# EAGLE schematic TN Deck__Main_Board (EAGLE 9.7.0)
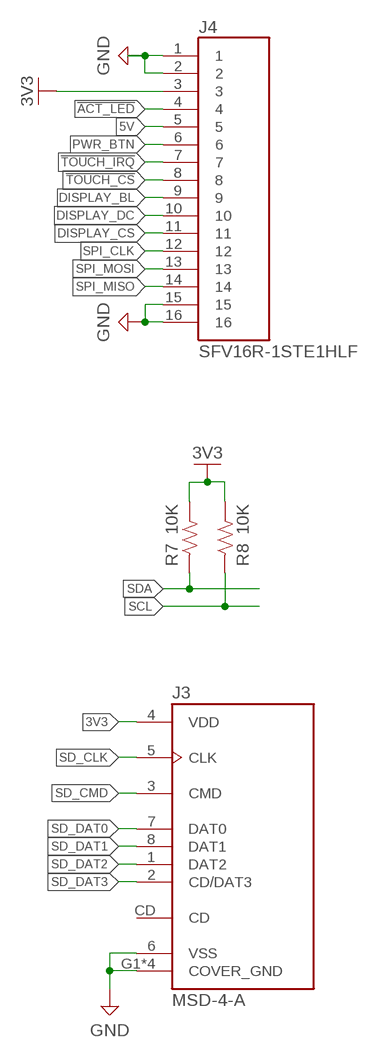
[diagram p0: schematic, sheet 1, part 1 of 2]
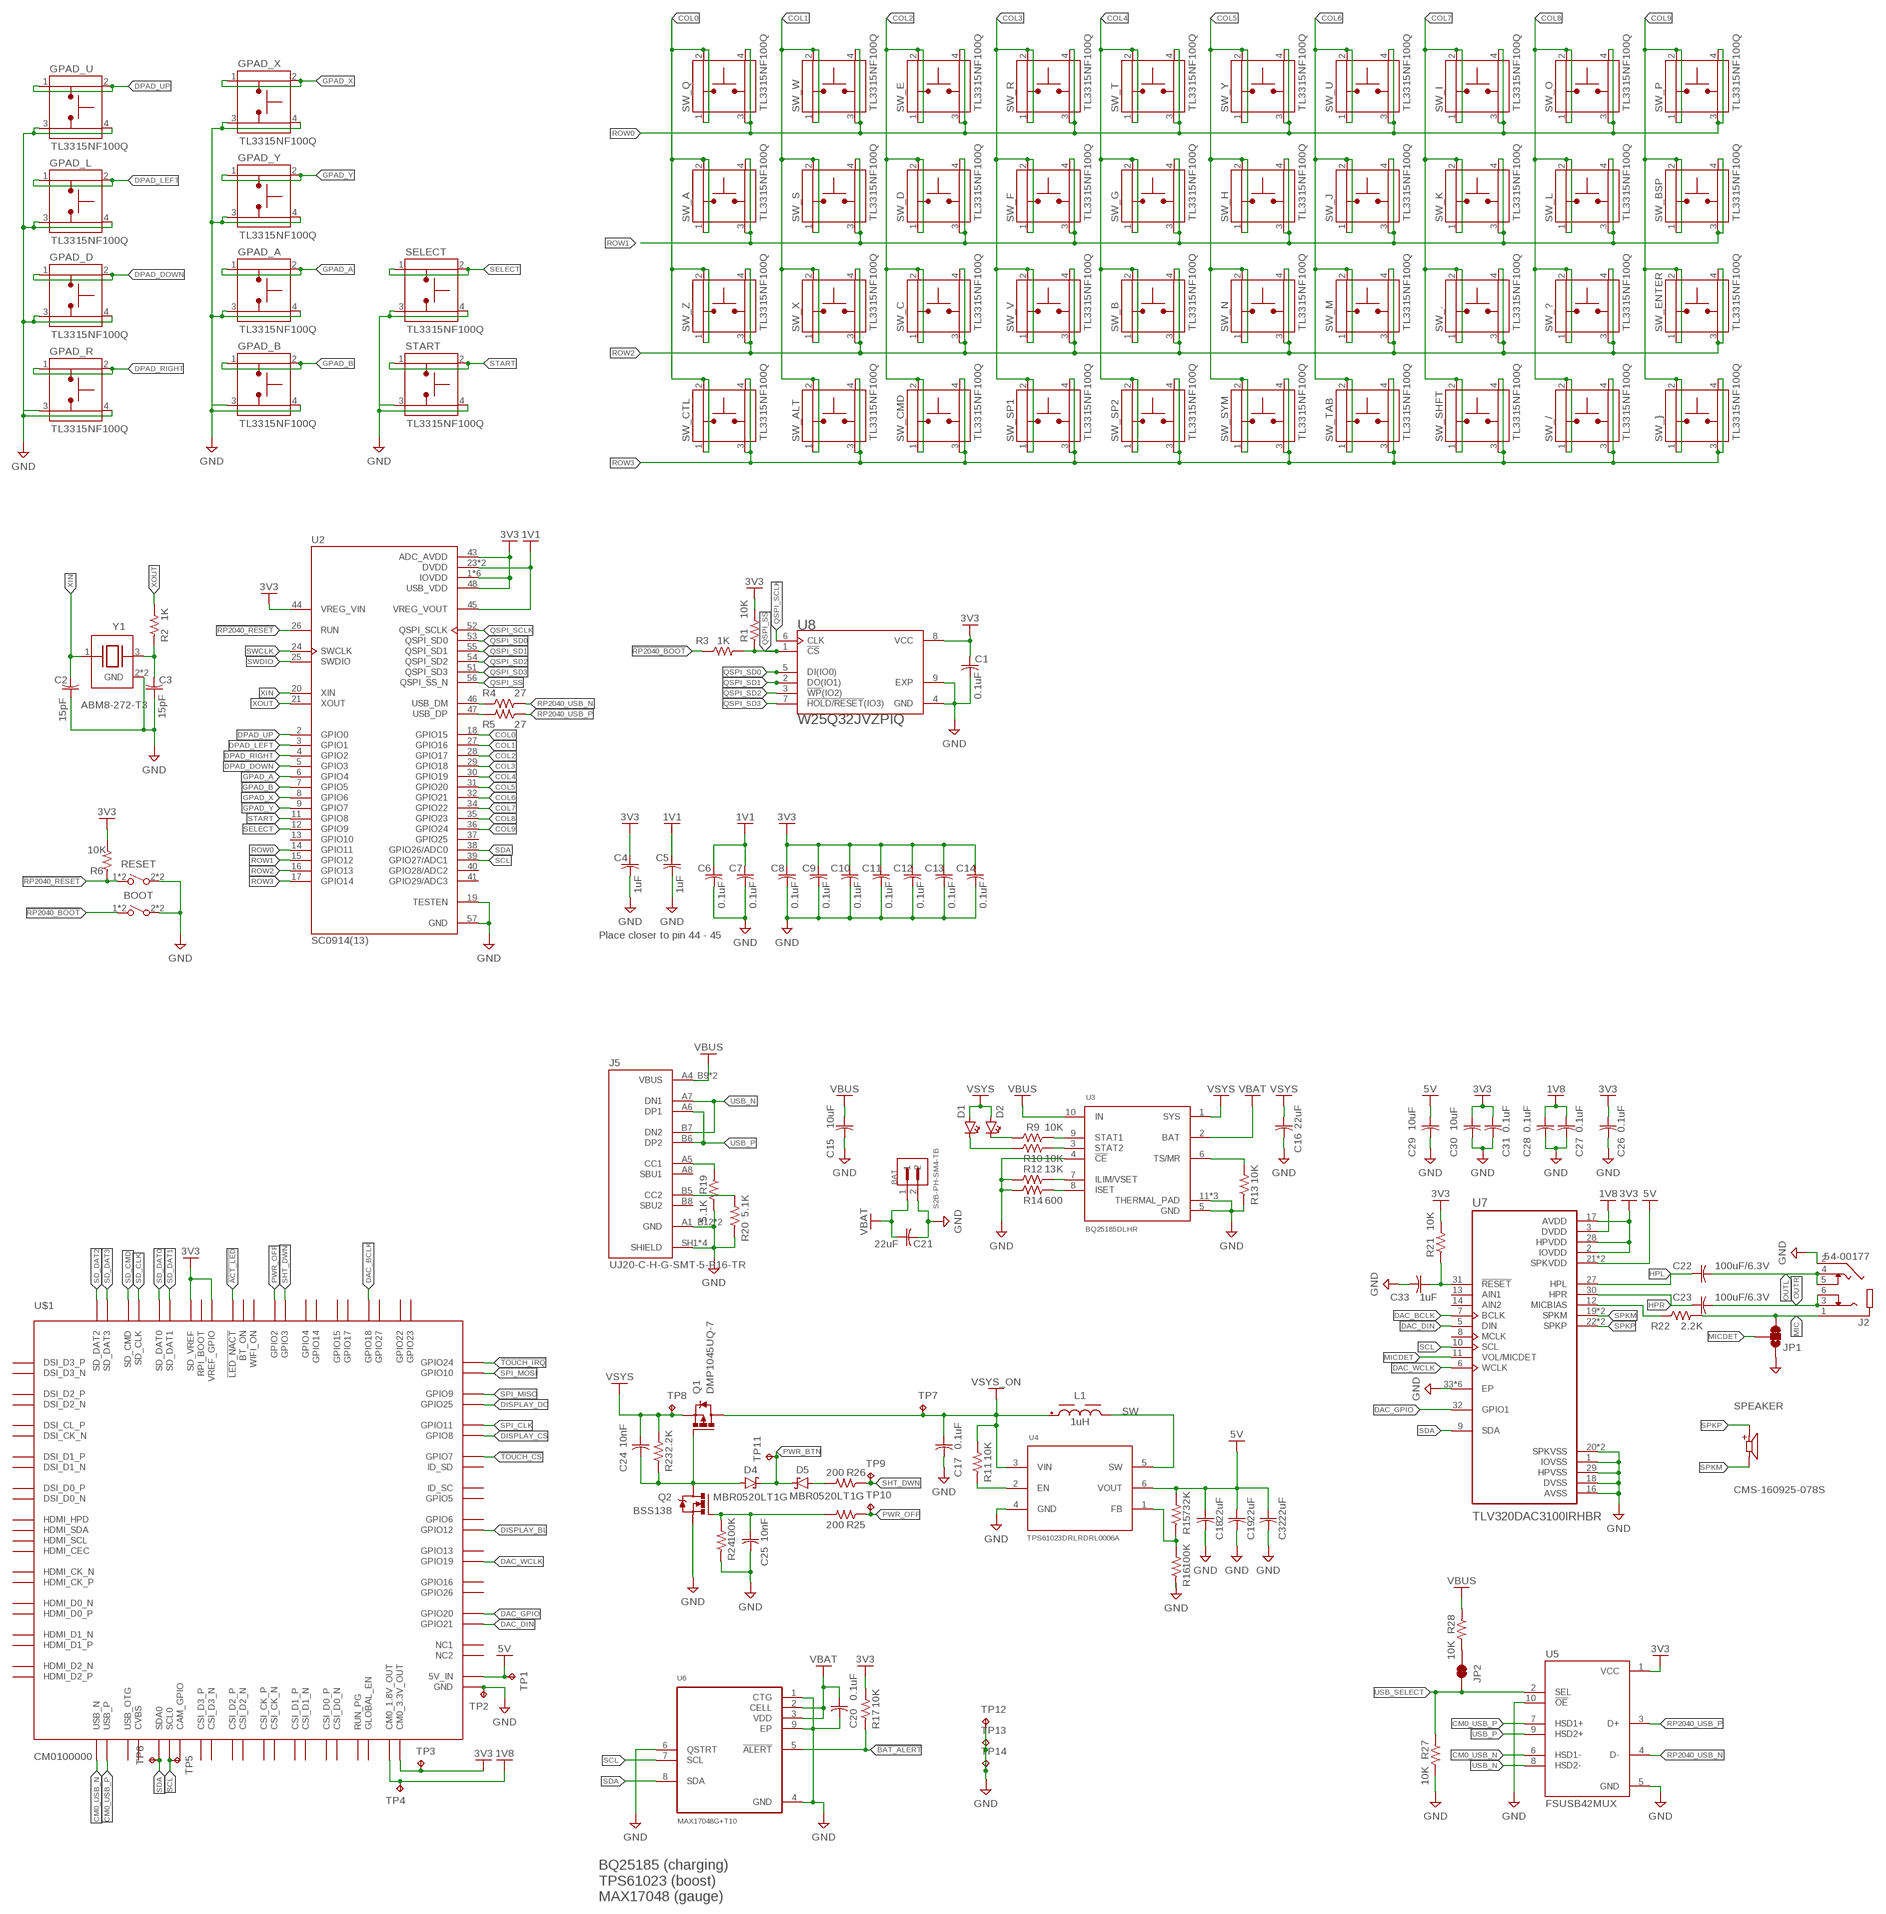
[diagram p1: schematic, sheet 1, part 2 of 2]

## Parts
BAT  S2B-PH-SM4-TB  [JST_S2B-PH-SM4-TB]
BOOT  SPST-NO_SWITCH_KMR2  [KMR2]
C1  0.1uF  C-US_CHIP-0603(1608-METRIC)  [CAPC1608X85]
C2  15pF  C-US_CHIP-0603(1608-METRIC)  [CAPC1608X85]
C3  15pF  C-US_CHIP-0603(1608-METRIC)  [CAPC1608X85]
C4  1uF  C-US_CHIP-0603(1608-METRIC)  [CAPC1608X85]
C5  1uF  C-US_CHIP-0603(1608-METRIC)  [CAPC1608X85]
C6  0.1uF  C-US_CHIP-0603(1608-METRIC)  [CAPC1608X85]
C7  0.1uF  C-US_CHIP-0603(1608-METRIC)  [CAPC1608X85]
C8  0.1uF  C-US_CHIP-0603(1608-METRIC)  [CAPC1608X85]
C9  0.1uF  C-US_CHIP-0603(1608-METRIC)  [CAPC1608X85]
C10  0.1uF  C-US_CHIP-0603(1608-METRIC)  [CAPC1608X85]
C11  0.1uF  C-US_CHIP-0603(1608-METRIC)  [CAPC1608X85]
C12  0.1uF  C-US_CHIP-0603(1608-METRIC)  [CAPC1608X85]
C13  0.1uF  C-US_CHIP-0603(1608-METRIC)  [CAPC1608X85]
C14  0.1uF  C-US_CHIP-0603(1608-METRIC)  [CAPC1608X85]
C15  10uF  C-US_CHIP-0805(2012-METRIC)  [CAPC2012X110]
C16  22uF  C-US_CHIP-0805(2012-METRIC)  [CAPC2012X110]
C17  0.1uF  C-US_CHIP-0603(1608-METRIC)  [CAPC1608X85]
C18  22uF  C-US_CHIP-0805(2012-METRIC)  [CAPC2012X110]
C19  22uF  C-US_CHIP-0805(2012-METRIC)  [CAPC2012X110]
C20  0.1uF  C-US_CHIP-0603(1608-METRIC)  [CAPC1608X85]
C21  22uF  C-US_CHIP-0805(2012-METRIC)  [CAPC2012X110]
C22  100uF/6.3V  C-US_CHIP-1206(3216-METRIC)  [CAPC3216X135]
C23  100uF/6.3V  C-US_CHIP-1206(3216-METRIC)  [CAPC3216X135]
C24  10nF  C-US_CHIP-0603(1608-METRIC)  [CAPC1608X85]
C25  10nF  C-US_CHIP-0603(1608-METRIC)  [CAPC1608X85]
C26  0.1uF  C-US_CHIP-0603(1608-METRIC)  [CAPC1608X85]
C27  0.1uF  C-US_CHIP-0603(1608-METRIC)  [CAPC1608X85]
C28  0.1uF  C-US_CHIP-0603(1608-METRIC)  [CAPC1608X85]
C29  10uF  C-US_CHIP-0805(2012-METRIC)  [CAPC2012X110]
C30  10uF  C-US_CHIP-0805(2012-METRIC)  [CAPC2012X110]
C31  0.1uF  C-US_CHIP-0603(1608-METRIC)  [CAPC1608X85]
C32  22uF  C-US_CHIP-0805(2012-METRIC)  [CAPC2012X110]
C33  1uF  C-US_CHIP-0603(1608-METRIC)  [CAPC1608X85]
D1  CHIP-FLAT-G_0603-0.80MM  [LEDC1608X80N_FLAT-G]
D2  CHIP-FLAT-R_0603-0.80MM  [LEDC1608X80N_FLAT-R]
D4  MBR0520LT1G  SCHOTTKY_MBR0520LT1GDO-219  [SODFL3718X115]
D5  MBR0520LT1G  SCHOTTKY_MBR0520LT1GDO-219  [SODFL3718X115]
GPAD_A  TL3315NF100Q  [TL3315NF100Q]
GPAD_B  TL3315NF100Q  [TL3315NF100Q]
GPAD_D  TL3315NF100Q  [TL3315NF100Q]
GPAD_L  TL3315NF100Q  [TL3315NF100Q]
GPAD_R  TL3315NF100Q  [TL3315NF100Q]
GPAD_U  TL3315NF100Q  [TL3315NF100Q]
GPAD_X  TL3315NF100Q  [TL3315NF100Q]
GPAD_Y  TL3315NF100Q  [TL3315NF100Q]
J2  54-00177  [TENSILITY_54-00177]
J3  MSD-4-A  [CUI_MSD-4-A]
J4  SFV16R-1STE1HLF  [AMPHENOL_SFV16R-1STE1HLF]
J5  UJ20-C-H-G-SMT-5-P16-TR  [SAMESKY_UJ20-C-H-G-SMT-5-P16-TR]
JP1  JUMPER-SMT_3_1-NC_TRACE_SILK  [SMT-JUMPER_3_1-NC_TRACE_SILK]
JP2  JUMPER-SMT_2_NC_TRACE_NO-SILK  [SMT-JUMPER_2_NC_TRACE_NO-SILK]
L1  1uH  WE-XHMI_4020_74439323010  [WE-XHMI_4020]
Q1  DMP1045UQ-7  PMOSFET_SOT23-GSD  [SOT23]
Q2  BSS138  NMOSFET_SOT23-GSD  [SOT23]
R1  10K  R-US_CHIP-0603(1608-METRIC)  [RESC1608X60]
R2  1K  R-US_CHIP-0603(1608-METRIC)  [RESC1608X60]
R3  1K  R-US_CHIP-0603(1608-METRIC)  [RESC1608X60]
R4  27  R-US_CHIP-0603(1608-METRIC)  [RESC1608X60]
R5  27  R-US_CHIP-0603(1608-METRIC)  [RESC1608X60]
R6  10K  R-US_CHIP-0603(1608-METRIC)  [RESC1608X60]
R7  10K  R-US_CHIP-0603(1608-METRIC)  [RESC1608X60]
R8  10K  R-US_CHIP-0603(1608-METRIC)  [RESC1608X60]
R9  10K  R-US_CHIP-0603(1608-METRIC)  [RESC1608X60]
R10  10K  R-US_CHIP-0603(1608-METRIC)  [RESC1608X60]
R11  10K  R-US_CHIP-0603(1608-METRIC)  [RESC1608X60]
R12  13K  R-US_CHIP-0603(1608-METRIC)  [RESC1608X60]
R13  10K  R-US_CHIP-0603(1608-METRIC)  [RESC1608X60]
R14  600  R-US_CHIP-0603(1608-METRIC)  [RESC1608X60]
R15  732K  R-US_CHIP-0603(1608-METRIC)  [RESC1608X60]
R16  100K  R-US_CHIP-0603(1608-METRIC)  [RESC1608X60]
R17  10K  R-US_CHIP-0603(1608-METRIC)  [RESC1608X60]
R19  5.1K  R-US_CHIP-0603(1608-METRIC)  [RESC1608X60]
R20  5.1K  R-US_CHIP-0603(1608-METRIC)  [RESC1608X60]
R21  10K  R-US_CHIP-0603(1608-METRIC)  [RESC1608X60]
R22  2.2K  R-US_CHIP-0603(1608-METRIC)  [RESC1608X60]
R23  2.2K  R-US_CHIP-0603(1608-METRIC)  [RESC1608X60]
R24  100K  R-US_CHIP-0603(1608-METRIC)  [RESC1608X60]
R25  200  R-US_CHIP-0603(1608-METRIC)  [RESC1608X60]
R26  200  R-US_CHIP-0603(1608-METRIC)  [RESC1608X60]
R27  10K  R-US_CHIP-0603(1608-METRIC)  [RESC1608X60]
R28  10K  R-US_CHIP-0603(1608-METRIC)  [RESC1608X60]
RESET  SPST-NO_SWITCH_KMR2  [KMR2]
SELECT  TL3315NF100Q  [TL3315NF100Q]
SPEAKER  CMS-160925-078S  [SPKR_CMS-160925-078S]
START  TL3315NF100Q  [TL3315NF100Q]
SW_.  TL3315NF100Q  [TL3315NF100Q]
SW_/  TL3315NF100Q  [TL3315NF100Q]
SW_?  TL3315NF100Q  [TL3315NF100Q]
SW_A  TL3315NF100Q  [TL3315NF100Q]
SW_ALT  TL3315NF100Q  [TL3315NF100Q]
SW_B  TL3315NF100Q  [TL3315NF100Q]
SW_BSP  TL3315NF100Q  [TL3315NF100Q]
SW_C  TL3315NF100Q  [TL3315NF100Q]
SW_CMD  TL3315NF100Q  [TL3315NF100Q]
SW_CTL  TL3315NF100Q  [TL3315NF100Q]
SW_D  TL3315NF100Q  [TL3315NF100Q]
SW_E  TL3315NF100Q  [TL3315NF100Q]
SW_ENTER  TL3315NF100Q  [TL3315NF100Q]
SW_F  TL3315NF100Q  [TL3315NF100Q]
SW_G  TL3315NF100Q  [TL3315NF100Q]
SW_H  TL3315NF100Q  [TL3315NF100Q]
SW_I  TL3315NF100Q  [TL3315NF100Q]
SW_J  TL3315NF100Q  [TL3315NF100Q]
SW_K  TL3315NF100Q  [TL3315NF100Q]
SW_L  TL3315NF100Q  [TL3315NF100Q]
SW_M  TL3315NF100Q  [TL3315NF100Q]
SW_N  TL3315NF100Q  [TL3315NF100Q]
SW_O  TL3315NF100Q  [TL3315NF100Q]
SW_P  TL3315NF100Q  [TL3315NF100Q]
SW_Q  TL3315NF100Q  [TL3315NF100Q]
SW_R  TL3315NF100Q  [TL3315NF100Q]
SW_S  TL3315NF100Q  [TL3315NF100Q]
SW_SHFT  TL3315NF100Q  [TL3315NF100Q]
SW_SP1  TL3315NF100Q  [TL3315NF100Q]
SW_SP2  TL3315NF100Q  [TL3315NF100Q]
SW_SYM  TL3315NF100Q  [TL3315NF100Q]
SW_T  TL3315NF100Q  [TL3315NF100Q]
SW_TAB  TL3315NF100Q  [TL3315NF100Q]
SW_U  TL3315NF100Q  [TL3315NF100Q]
SW_V  TL3315NF100Q  [TL3315NF100Q]
SW_W  TL3315NF100Q  [TL3315NF100Q]
SW_X  TL3315NF100Q  [TL3315NF100Q]
SW_Y  TL3315NF100Q  [TL3315NF100Q]
SW_Z  TL3315NF100Q  [TL3315NF100Q]
SW_}  TL3315NF100Q  [TL3315NF100Q]
TP1  TPB1,27  [B1,27]
TP2  TPB1,27  [B1,27]
TP3  TPB1,27  [B1,27]
TP4  TPB1,27  [B1,27]
TP5  TPB1,27  [B1,27]
TP6  TPB1,27  [B1,27]
TP7  TPB1,27  [B1,27]
TP8  TPB1,27  [B1,27]
TP9  TPB1,27  [B1,27]
TP10  TPB1,27  [B1,27]
TP11  TPB1,27  [B1,27]
TP12  TPB1,27  [B1,27]
TP13  TPB1,27  [B1,27]
TP14  TPB1,27  [B1,27]
U2  SC0914(13)  [QFN40P700X700X90-57N]
U3  BQ25185DLHR  [IC_BQ25185DLHR]
U4  TPS61023DRLRDRL0006A  [DRL0006A]
U5  FSUSB42MUX  [SOP50P490X110-10N]
U6  MAX17048G+T10  [SON50P200X200X80-9N]
U7  TLV320DAC3100IRHBR  [IC_ADS125H01IRHBT]
U8  W25Q32JVZPIQ  [SON127P600X500X80-9N]
U$1  CM0100000  [CM0]
Y1  ABM8-272-T3  [XTAL_ABM8-272-T3]

## Nets
1V1: C5.1 C6.1 C7.1 U2.23(DVDD) U2.45(VREG_VOUT) U2.50(DVDD)
1V8: C27.1 C28.1 TP4.TP U7.3(DVDD) U$1.P$64(CM0_1.8V_OUT) U$1.P$65(CM0_1.8V_OUT)
3V3: C1.1 C4.1 C8.1 C9.1 C10.1 C11.1 C12.1 C13.1 C14.1 C26.1 C30.1 C31.1 J3.4(VDD) J4.3 R1.2 R6.2 R7.2 R8.2 R17.2 R21.2 TP3.TP U2.1(IOVDD) U2.10(IOVDD) U2.22(IOVDD) U2.33(IOVDD) U2.42(IOVDD) U2.43(ADC_AVDD) U2.44(VREG_VIN) U2.48(USB_VDD) U2.49(IOVDD) U5.1(VCC) U7.2(IOVDD) U7.17(AVDD) U7.28(HPVDD) U8.8(VCC) U$1.P$41(CM0_3.3V_OUT) U$1.P$119(CM0_3.3V_OUT) U$1.P$120(VREF_GPIO) U$1.P$122(SD_VREF)
5V: C18.1 C19.1 C29.1 C32.1 J4.5 R15.2 TP1.TP U4.6(VOUT) U7.21(SPKVDD) U7.24(SPKVDD) U$1.P$67(5V_IN) U$1.P$68(5V_IN)
!ACT_LED: J4.4 U$1.P$118(!LED_NACT)
!BAT_ALERT: R17.1 U6.5(!ALERT)
!RP2040_BOOT: BOOT.1 BOOT.4 R3.1
!RP2040_RESET: R6.1 RESET.1 RESET.4 U2.26(RUN)
!TOUCH_CS: J4.8 U$1.P$89(GPIO7)
!TOUCH_IRQ: J4.7 U$1.P$98(GPIO24)
CM0_USB_N: U5.6(HSD1-) U$1.P$35(USB_N)
CM0_USB_P: U5.7(HSD1+) U$1.P$36(USB_P)
COL0: SW_A.1 SW_A.2 SW_CTL.1 SW_CTL.2 SW_Q.1 SW_Q.2 SW_Z.1 SW_Z.2 U2.18(GPIO15)
COL1: SW_ALT.1 SW_ALT.2 SW_S.1 SW_S.2 SW_W.1 SW_W.2 SW_X.1 SW_X.2 U2.27(GPIO16)
COL2: SW_C.1 SW_C.2 SW_CMD.1 SW_CMD.2 SW_D.1 SW_D.2 SW_E.1 SW_E.2 U2.28(GPIO17)
COL3: SW_F.1 SW_F.2 SW_R.1 SW_R.2 SW_SP1.1 SW_SP1.2 SW_V.1 SW_V.2 U2.29(GPIO18)
COL4: SW_B.1 SW_B.2 SW_G.1 SW_G.2 SW_SP2.1 SW_SP2.2 SW_T.1 SW_T.2 U2.30(GPIO19)
COL5: SW_H.1 SW_H.2 SW_N.1 SW_N.2 SW_SYM.1 SW_SYM.2 SW_Y.1 SW_Y.2 U2.31(GPIO20)
COL6: SW_J.1 SW_J.2 SW_M.1 SW_M.2 SW_TAB.1 SW_TAB.2 SW_U.1 SW_U.2 U2.32(GPIO21)
COL7: SW_..1 SW_..2 SW_I.1 SW_I.2 SW_K.1 SW_K.2 SW_SHFT.1 SW_SHFT.2 U2.34(GPIO22)
COL8: SW_/.1 SW_/.2 SW_?.1 SW_?.2 SW_L.1 SW_L.2 SW_O.1 SW_O.2 U2.35(GPIO23)
COL9: SW_BSP.1 SW_BSP.2 SW_ENTER.1 SW_ENTER.2 SW_P.1 SW_P.2 SW_}.1 SW_}.2 U2.36(GPIO24)
DAC_BCLK: U7.7(BCLK) U$1.P$105(GPIO18)
DAC_DIN: U7.5(DIN) U$1.P$73(GPIO21)
DAC_GPIO: U7.32(GPIO1) U$1.P$74(GPIO20)
DAC_WCLK: U7.6(WCLK) U$1.P$79(GPIO19)
DISPLAY_BL: J4.9 U$1.P$82(GPIO12)
DISPLAY_CS: J4.11 U$1.P$91(GPIO8)
DISPLAY_DC: J4.10 U$1.P$94(GPIO25)
DPAD_DOWN: GPAD_D.1 GPAD_D.2 U2.5(GPIO3)
DPAD_LEFT: GPAD_L.1 GPAD_L.2 U2.3(GPIO1)
DPAD_RIGHT: GPAD_R.1 GPAD_R.2 U2.4(GPIO2)
DPAD_UP: GPAD_U.1 GPAD_U.2 U2.2(GPIO0)
GND: BAT.2 BOOT.2 BOOT.3 C1.2 C2.1 C3.1 C4.2 C5.2 C6.2 C7.2 C8.2 C9.2 C10.2 C11.2 C12.2 C13.2 C14.2 C15.2 C16.2 C17.2 C18.2 C19.2 C20.2 C21.2 C25.2 C26.2 C27.2 C28.2 C29.2 C30.2 C31.2 C32.2 C33.2 GPAD_A.3 GPAD_A.4 GPAD_B.3 GPAD_B.4 GPAD_D.3 GPAD_D.4 GPAD_L.3 GPAD_L.4 GPAD_R.3 GPAD_R.4 GPAD_U.3 GPAD_U.4 GPAD_X.3 GPAD_X.4 GPAD_Y.3 GPAD_Y.4 J2.2 J3.6(VSS) J3.G1(COVER_GND) J3.G2(COVER_GND) J3.G3(COVER_GND) J3.G4(COVER_GND) J4.1 J4.2 J4.15 J4.16 J5.A1_B12(GND) J5.A12_B1(GND) J5.SH1(SHIELD) J5.SH2(SHIELD) J5.SH3(SHIELD) J5.SH4(SHIELD) JP1.1 Q2.2(S) R12.1 R13.1 R14.1 R16.1 R19.2 R20.1 R24.1 R27.2 RESET.2 RESET.3 SELECT.3 SELECT.4 START.3 START.4 TP2.TP TP12.TP TP13.TP TP14.TP U2.19(TESTEN) U2.57(GND) U3.4(!CE) U3.5(GND) U3.11(THERMAL_PAD) U3.12(THERMAL_PAD) U3.13(THERMAL_PAD) U4.4(GND) U5.5(GND) U5.10(!OE) U6.1(CTG) U6.4(GND) U6.6(QSTRT) U6.9(EP) U7.1(IOVSS) U7.16(AVSS) U7.18(DVSS) U7.20(SPKVSS) U7.25(SPKVSS) U7.29(HPVSS) U7.33(EP) U7.34(EP) U7.35(EP) U7.36(EP) U7.37(EP) U7.38(EP) U8.4(GND) U8.9(EXP) U$1.P$1(GND) U$1.P$4(GND) U$1.P$7(GND) U$1.P$10(GND) U$1.P$13(GND) U$1.P$16(GND) U$1.P$21(GND) U$1.P$24(GND) U$1.P$27(GND) U$1.P$30(GND) U$1.P$33(GND) U$1.P$34(GND) U$1.P$37(GND) U$1.P$40(GND) U$1.P$45(GND) U$1.P$48(GND) U$1.P$51(GND) U$1.P$54(GND) U$1.P$57(GND) U$1.P$60(GND) U$1.P$63(GND) U$1.P$66(GND) U$1.P$69(GND) U$1.P$72(GND) U$1.P$75(GND) U$1.P$78(GND) U$1.P$81(GND) U$1.P$84(GND) U$1.P$87(GND) U$1.P$90(GND) U$1.P$93(GND) U$1.P$96(GND) U$1.P$99(GND) U$1.P$100(GND) U$1.P$103(GND) U$1.P$106(GND) U$1.P$109(GND) U$1.P$112(GND) U$1.P$115(GND) U$1.P$123(GND) U$1.P$126(GND) U$1.P$129(GND) U$1.P$132(GND) Y1.2(GND) Y1.4(GND)
GPAD_A: GPAD_A.1 GPAD_A.2 U2.6(GPIO4)
GPAD_B: GPAD_B.1 GPAD_B.2 U2.7(GPIO5)
GPAD_X: GPAD_X.1 GPAD_X.2 U2.8(GPIO6)
GPAD_Y: GPAD_Y.1 GPAD_Y.2 U2.9(GPIO7)
HPL: C22.1 U7.27(HPL)
HPR: C23.1 U7.30(HPR)
MIC: J2.1 JP1.3 R22.2
MICBIAS: R22.1 U7.12(MICBIAS)
MICDET: JP1.2 U7.11(VOL/MICDET)
N$1: R12.2 U3.7(ILIM/VSET)
N$2: R14.2 U3.8(ISET)
N$3: R13.2 U3.6(TS/MR)
N$4: R9.2 U3.9(STAT1)
N$5: D2.C R9.1
N$6: R10.2 U3.3(STAT2)
N$7: D1.C R10.1
N$8: R11.1 U4.2(EN)
N$10: C3.2 R2.1 Y1.3
N$12: J5.A5(CC1) R19.1
N$13: R15.1 R16.2 U4.1(FB)
N$16: J5.B5(CC2) R20.2
N$17: C33.1 R21.1 U7.31(!RESET)
N$19: C25.1 Q2.1(G) R24.2 R25.2
N$20: C24.2 D4.2(A) Q1.1(G) Q2.3(D) R23.1
N$21: D5.2(A) R26.2
N$23: JP2.2 R28.2
OUTL: C22.2 J2.4 J2.5
OUTR: C23.2 J2.3 J2.6
PWR_BTN: D4.1(C) D5.1(C) J4.6 TP11.TP
PWR_OFF: R25.1 TP10.TP U$1.P$114(GPIO2)
QSPI_SCLK: U2.52(QSPI_SCLK) U8.6(CLK)
QSPI_SD0: U2.53(QSPI_SD0) U8.5(DI(IO0))
QSPI_SD1: U2.55(QSPI_SD1) U8.2(DO(IO1))
QSPI_SD2: U2.54(QSPI_SD2) U8.3(!WP!(IO2))
QSPI_SD3: U2.51(QSPI_SD3) U8.7(!HOLD/RESET!(IO3))
QSPI_SS: R1.1 R3.2 U2.56(QSPI_SS_N) U8.1(!CS)
ROW0: SW_E.3 SW_E.4 SW_I.3 SW_I.4 SW_O.3 SW_O.4 SW_P.3 SW_P.4 SW_Q.3 SW_Q.4 SW_R.3 SW_R.4 SW_T.3 SW_T.4 SW_U.3 SW_U.4 SW_W.3 SW_W.4 SW_Y.3 SW_Y.4 U2.14(GPIO11)
ROW1: SW_A.3 SW_A.4 SW_BSP.3 SW_BSP.4 SW_D.3 SW_D.4 SW_F.3 SW_F.4 SW_G.3 SW_G.4 SW_H.3 SW_H.4 SW_J.3 SW_J.4 SW_K.3 SW_K.4 SW_L.3 SW_L.4 SW_S.3 SW_S.4 U2.15(GPIO12)
ROW2: SW_..3 SW_..4 SW_?.3 SW_?.4 SW_B.3 SW_B.4 SW_C.3 SW_C.4 SW_ENTER.3 SW_ENTER.4 SW_M.3 SW_M.4 SW_N.3 SW_N.4 SW_V.3 SW_V.4 SW_X.3 SW_X.4 SW_Z.3 SW_Z.4 U2.16(GPIO13)
ROW3: SW_/.3 SW_/.4 SW_ALT.3 SW_ALT.4 SW_CMD.3 SW_CMD.4 SW_CTL.3 SW_CTL.4 SW_SHFT.3 SW_SHFT.4 SW_SP1.3 SW_SP1.4 SW_SP2.3 SW_SP2.4 SW_SYM.3 SW_SYM.4 SW_TAB.3 SW_TAB.4 SW_}.3 SW_}.4 U2.17(GPIO14)
RP2040_USB_N: R4.2 U5.4(D-)
RP2040_USB_P: R5.1 U5.3(D+)
RP2040_USBT_N: R4.1 U2.46(USB_DM)
RP2040_USBT_P: R5.2 U2.47(USB_DP)
SCL: R8.1 TP5.TP U2.39(GPIO27/ADC1) U6.7(SCL) U7.10(SCL) U$1.P$43(SCL0)
SD_CLK: J3.5(CLK) U$1.P$127(SD_CLK)
SD_CMD: J3.3(CMD) U$1.P$128(SD_CMD)
SD_DAT0: J3.7(DAT0) U$1.P$125(SD_DAT0)
SD_DAT1: J3.8(DAT1) U$1.P$124(SD_DAT1)
SD_DAT2: J3.1(DAT2) U$1.P$131(SD_DAT2)
SD_DAT3: J3.2(CD/DAT3) U$1.P$130(SD_DAT3)
SDA: R7.1 TP6.TP U2.38(GPIO26/ADC0) U6.8(SDA) U7.9(SDA) U$1.P$42(SDA0)
SELECT: SELECT.1 SELECT.2 U2.12(GPIO9)
SHT_DWN: R26.1 TP9.TP U$1.P$113(GPIO3)
SPI_CLK: J4.12 U$1.P$92(GPIO11)
SPI_MISO: J4.14 U$1.P$95(GPIO9)
SPI_MOSI: J4.13 U$1.P$97(GPIO10)
SPKM: SPEAKER.M U7.19(SPKM) U7.23(SPKM)
SPKP: SPEAKER.P U7.22(SPKP) U7.26(SPKP)
START: START.1 START.2 U2.11(GPIO8)
SW: L1.2 U4.5(SW)
SWCLK: U2.24(SWCLK)
SWDIO: U2.25(SWDIO)
USB_N: J5.A7(DN1) J5.B7(DN2) U5.8(HSD2-)
USB_P: J5.A6(DP1) J5.B6(DP2) U5.9(HSD2+)
USB_SELECT: JP2.1 R27.1 U5.2(SEL)
VBAT: BAT.1 C20.1 C21.1 U3.2(BAT) U6.2(CELL) U6.3(VDD)
VBUS: C15.1 J5.A4_B9(VBUS) J5.B4_A9(VBUS) R28.1 U3.10(IN)
VSYS: C16.1 C24.1 D1.A D2.A Q1.2(S) R23.2 TP8.TP U3.1(SYS)
VSYS_ON: C17.1 L1.1 Q1.3(D) R11.2 TP7.TP U4.3(VIN)
XIN: C2.2 U2.20(XIN) Y1.1
XOUT: R2.2 U2.21(XOUT)
Unconnected: J3.CD J5.A8(SBU1) J5.B8(SBU2) U2.13(GPIO10) U2.37(GPIO25) U2.40(GPIO28/ADC2) U2.41(GPIO29/ADC3) U7.8(MCLK) U7.13(AIN1) U7.14(AIN2) U$1.P$2(DSI_D3_P) U$1.P$3(DSI_D3_N) U$1.P$5(DSI_D2_P) U$1.P$6(DSI_D2_N) U$1.P$8(DSI_CL_P) U$1.P$9(DSI_CK_N) U$1.P$11(DSI_D1_P) U$1.P$12(DSI_D1_N) U$1.P$14(DSI_D0_P) U$1.P$15(DSI_D0_N) U$1.P$17(HDMI_HPD) U$1.P$18(HDMI_SDA) U$1.P$19(HDMI_SCL) U$1.P$20(HDMI_CEC) U$1.P$22(HDMI_CK_N) U$1.P$23(HDMI_CK_P) U$1.P$25(HDMI_D0_N) U$1.P$26(HDMI_D0_P) U$1.P$28(HDMI_D1_N) U$1.P$29(HDMI_D1_P) U$1.P$31(HDMI_D2_N) U$1.P$32(HDMI_D2_P) U$1.P$38(USB_OTG) U$1.P$39(CVBS) U$1.P$44(CAM_GPIO) U$1.P$46(CSI_D3_P) U$1.P$47(CSI_D3_N) U$1.P$49(CSI_D2_P) U$1.P$50(CSI_D2_N) U$1.P$52(CSI_CK_P) U$1.P$53(CSI_CK_N) U$1.P$55(CSI_D1_P) U$1.P$56(CSI_D1_N) U$1.P$58(CSI_D0_P) U$1.P$59(CSI_D0_N) U$1.P$61(RUN_PG) U$1.P$62(GLOBAL_EN) U$1.P$70(NC1) U$1.P$71(NC2) U$1.P$76(GPIO26) U$1.P$77(GPIO16) U$1.P$80(GPIO13) U$1.P$83(GPIO6) U$1.P$85(GPIO5) U$1.P$86(ID_SC) U$1.P$88(ID_SD) U$1.P$101(GPIO23) U$1.P$102(GPIO22) U$1.P$104(GPIO27) U$1.P$107(GPIO17) U$1.P$108(GPIO15) U$1.P$110(GPIO14) U$1.P$111(GPIO4) U$1.P$116(WIFI_ON) U$1.P$117(BT_ON) U$1.P$121(RPI_BOOT)

## Notes on the sheet
- Place closer to pin 44 - 45
- BQ25185 (charging)
  TPS61023 (boost)
  MAX17048 (gauge)

## Library data of the parts
BAT = S2B-PH-SM4-TB:S2B-PH-SM4-TB; MANUFACTURER: JST; VENDOR: Digikey; VPN: 455-S2B-PH-SM4-TBCT-ND
BOOT RESET = Switch:SPST-NO_SWITCH: SPST Switches with NO Configuration; CATEGORY: Switches; DATASHEET: https://www.ckswitches.com/media/1479/kmr2.pdf; DESCRIPTION: Tactile Switch SPST-NO Top Actuated Surface Mount; MANUFACTURER: C&K; MPN: KMR211G LFS; OPERATING_TEMPERATURE: -40°C ~ 85°C; PACKAGE_SIZE: NA; PACKAGE_TYPE: Surface Mount; PART_STATUS: Active; ROHS: Compliant; SERIES: KMR2; SUBCATEGORY: Tactile Switches; TYPE: SPST-NO; VENDOR: Digikey; VPN: 401-1426-1-ND
C1 C6-C14 C17 C20 C26-C28 C31 C33 = Capacitor:C-US: Capacitor - ANSI; CATEGORY: Capacitor; PACKAGE_SIZE: 0603; PACKAGE_TYPE: Surface Mount; SUBCATEGORY: Ceramic Capacitors; TYPE: MLCC; VENDOR: Digikey; VPN: 399-C0603C104K3RACTUCT-ND
C2 C3 = Capacitor:C-US: Capacitor - ANSI; CATEGORY: Capacitor; PACKAGE_SIZE: 0603; PACKAGE_TYPE: Surface Mount; SUBCATEGORY: Ceramic Capacitors; TYPE: MLCC; VENDOR: Digikey; VPN: 732-7761-1-ND
C4 C5 = Capacitor:C-US: Capacitor - ANSI; CATEGORY: Capacitor; PACKAGE_SIZE: 0603; PACKAGE_TYPE: Surface Mount; SUBCATEGORY: Ceramic Capacitors; TYPE: MLCC; VENDOR: Digikey; VPN: 399-C0603C105K4RACTUCT-ND
C15 C29 C30 = Capacitor:C-US: Capacitor - ANSI; CATEGORY: Capacitor; PACKAGE_SIZE: 0805; PACKAGE_TYPE: Surface Mount; SUBCATEGORY: Ceramic Capacitors; TYPE: MLCC; VENDOR: Digikey; VPN: 1292-0805X106K250CT-ND
C16 C18 C19 C21 C32 = Capacitor:C-US: Capacitor - ANSI; CATEGORY: Capacitor; PACKAGE_SIZE: 0805; PACKAGE_TYPE: Surface Mount; SUBCATEGORY: Ceramic Capacitors; TYPE: MLCC; VENDOR: Digikey; VPN: 4713-GMC21X5R226M16NTCT-ND
C22 C23 = Capacitor:C-US: Capacitor - ANSI; CATEGORY: Capacitor; PACKAGE_SIZE: 1206; PACKAGE_TYPE: Surface Mount; SUBCATEGORY: Ceramic Capacitors; TYPE: MLCC; VENDOR: Digikey; VPN: 1276-CL31A107MQHNNWECT-ND
C24 C25 = Capacitor:C-US: Capacitor - ANSI; CATEGORY: Capacitor; PACKAGE_SIZE: 0603; PACKAGE_TYPE: Surface Mount; SUBCATEGORY: Ceramic Capacitors; TYPE: MLCC; VENDOR: Digikey; VPN: 399-C0603C103K4RACTUCT-ND
D1 = LED:CHIP-FLAT-G: Green LED - Generic; CATEGORY: LED; COLOR: Green; DESCRIPTION: Green LED Indication 0603 (1608 Metric); PACKAGE_SIZE: 0603; PACKAGE_TYPE: Surface Mount; SUBCATEGORY: Chip LED; TYPE: Square with Flat Top; VENDOR: Digikey; VPN: 732-4980-1-ND
D2 = LED:CHIP-FLAT-R: Red LED - Generic; CATEGORY: LED; COLOR: Red; DESCRIPTION: Red LED Indication 0603 (1608 Metric); PACKAGE_SIZE: 0603; PACKAGE_TYPE: Surface Mount; SUBCATEGORY: Chip LED; TYPE: Square with Flat Top; VENDOR: Digikey; VPN: 732-4978-1-ND
D4 D5 = Diode:SCHOTTKY_: Schottky Diode - Popular parts; CATEGORY: Diode; DESCRIPTION: DIODE SCHOTTKY 20V 500MA SOD123; MANUFACTURER: ON Semiconductor; MPN: MBR0520LT1G; SUB-CATEGORY: Schottky; VENDOR: Digikey; VPN: MBR0520LT1GOSCT-ND
GPAD_A GPAD_B GPAD_D GPAD_L GPAD_R GPAD_U GPAD_X GPAD_Y SELECT START SW_. SW_/ SW_? SW_A SW_ALT SW_B SW_BSP SW_C SW_CMD SW_CTL SW_D SW_E SW_ENTER SW_F SW_G SW_H SW_I SW_J SW_K SW_L SW_M SW_N SW_O SW_P SW_Q SW_R SW_S SW_SHFT SW_SP1 SW_SP2 SW_SYM SW_T SW_TAB SW_U SW_V SW_W SW_X SW_Y SW_Z SW_} = Switch:TL3315NF100Q: SWITCH TACTILE SPST-NO 0.05A 15V Manufacturer's datasheet <http://spec_sheets.e-switch.com/specs/P010336.pdf>; CREATED_BY: PCBLayout.com; DIGIKEY_PARTNO: EG4620TR-ND; MANUFACTURER: E-Switch; MPN: TL3315NF100Q; VENDOR: Digikey; VPN: EG4620CT-ND
J2 = 54-00177:54-00177; MANUFACTURER: TENSILITY; MAXIMUM_PACKAGE_HEIGHT: 4.5mm; PARTREV: A; SNAPEDA_PN: 54-00177; STANDARD: Manufacturer Recommendations; VENDOR: Digikey; VPN: 839-54-00177CT-ND
J3 = MSD-4-A:MSD-4-A; MANUFACTURER: CUI Devices; MAXIMUM_PACKAGE_HEIGHT: 2.00mm; PARTREV: 1.0; STANDARD: Manufacturer Recommendations; VENDOR: Digikey; VPN: 2223-MSD-4-ACT-ND
J4 = SFV16R-1STE1HLF:SFV16R-1STE1HLF; MANUFACTURER: Amphenol; MAXIMUM_PACKAGE_HEIGHT: 2.36mm; PARTREV: B; STANDARD: Manufacturer Recommendations; VENDOR: Digikey; VPN: 609-4313-1-ND
J5 = UJ20-C-H-G-SMT-5-P16-TR:UJ20-C-H-G-SMT-5-P16-TR; CREATOR: AMINA; MANUFACTURER: Same Sky; MAXIMUM_PACKAGE_HEIGHT: 3.41mm; PARTREV: 1.01; STANDARD: Manufacturer Recommendations; VENDOR: Digikey; VERIFIER: Your name, use the same always; VPN: 2223-UJ20-C-H-G-SMT-5-P16-TRCT-ND
JP1 = SparkFun-Jumpers:JUMPER-SMT_3_1-NC_TRACE: Normally closed trace jumper (1 of 2 connections) This jumper has a trace between two pads so it's normally closed (NC). The other connection is normally open (NO). Use a razor knife to open the connection. For best results follow the IPC guidelines for cutting traces: Cutout at least 0.063 mm (0.005 in). Remove all loose material to clean up the cut area. Seal the cut with an approved epoxy. Reapply solder to reclose the connection, or to close the NO connection.
JP2 = SparkFun-Jumpers:JUMPER-SMT_2_NC_TRACE: Normally closed trace jumper This jumper has a trace between two pads so it's normally closed (NC). Use a razor knife to open the connection. For best results follow the IPC guidelines for cutting traces: Cutout at least 0.063 mm (0.005 in). Remove all loose material to clean up the cut area. Seal the cut with an approved epoxy. Reapply solder to reclose the connection.
L1 = Wurth_Power Magnetics_WE-XHMI:WE-XHMI_4020: WE-XHMI SMT Power Inductor Shielded Characteristicscs Flat wire coil for low copper losses Composite core material allows high saturation currents Compact design Magnetically shielded High current capability and handles high transient current spikes Low leakage flux noise Operating temperature: -40°C up to +125°C WE-XHMI Performance: Operating temperature: -55°C up to +150°C Optimized for ultra low RDC and AC losses to enhance efficiency and minimize self-heating WE-XHMI: Operating temperature: -40°C up to +125°C Reliable inductor featuring a balanced combination of low losses and high current capability Applications DC/DC-converter for high current power supplies DC/DC-converter for Field Programmable Gate Array (FPGA) Power supplies for mobile devices POL-converters Mainboards/ graphic cards Battery powered devices Wireless communication devices Filter <https://www.we-online.com/components/media/o14900v209%20FAMILY-WE-XHMI.jpg> Details see: www.we-online.com/en/components/products/WE-XHMI <www.we-online.com/catalog/WE-XHMI/?utm_source=eagle_model&utm_medium=description_link&utm_campaign=eisos_eagle> Updated by Ella Wu 2024-09-18 2024 (C) Würth Elektronik; DATASHEET-URL: https://www.we-online.com/redexpert/spec/74439323010?ae; FRES: 60MHz; HEIGHT: 2mm; IRP: 10A@40K; ISAT: 10.2A@30%; L: 1uH; LENGTH: 4.3mm; MOUNT: SMT; PART-NUMBER: 74439323010; RDC-MAX: 13.44mOhm; RDC-TYP: 10.7mOhm; SIZE: 4020; VENDOR: Digikey; VPN: 732-11310-1-ND; WIDTH: 4.3mm
Q1 = Transistor:PMOSFET: P-Channel MOSFET - Generic; CATEGORY: Transistor; DATASHEET: https://www.analog.com/media/en/package-pcb-resources/package/pkg_pdf/ltc-legacy-sot-23/sot3%2005-08-1631%20rev%20d.pdf; DESCRIPTION: Generic P-Channel MOSFET Surface Mount SOT23 Package; PACKAGE_SIZE: SOT23; PACKAGE_TYPE: Surface Mount; SUBCATEGORY: MOSFET; TYPE: P-Channel; VENDOR: Digikey; VPN: 31-DMP1045UQ-7CT-ND
Q2 = Transistor:NMOSFET: N-Channel MOSFET - Generic; CATEGORY: Transistor; DATASHEET: https://www.analog.com/media/en/package-pcb-resources/package/pkg_pdf/ltc-legacy-sot-23/sot3%2005-08-1631%20rev%20d.pdf; DESCRIPTION: Generic N Channel MOSFET SOT23-GSD Package Surface Mount; PACKAGE_SIZE: SOT23; PACKAGE_TYPE: Surface Mount; SUBCATEGORY: MOSFET; TYPE: N-Channel; VENDOR: Digikey; VPN: BSS138CT-ND
R1 R6-R11 R13 R17 R21 R23 R27 R28 = Resistor:R-US: Resistor Fixed - ANSI; CATEGORY: Resistors; DESCRIPTION: Chip Resistor 1.60 X 0.82 X 0.60 mm body 0603(1608-METRIC) Package; PACKAGE_SIZE: 0603; PACKAGE_TYPE: Surface Mount; VENDOR: Digikey; VPN: 541-10.0KHCT-ND
R2 R3 = Resistor:R-US: Resistor Fixed - ANSI; CATEGORY: Resistors; DESCRIPTION: Chip Resistor 1.60 X 0.82 X 0.60 mm body 0603(1608-METRIC) Package; PACKAGE_SIZE: 0603; PACKAGE_TYPE: Surface Mount; VENDOR: Digikey; VPN: 541-1.00KHCT-ND
R4 R5 = Resistor:R-US: Resistor Fixed - ANSI; CATEGORY: Resistors; DESCRIPTION: Chip Resistor 1.60 X 0.82 X 0.60 mm body 0603(1608-METRIC) Package; PACKAGE_SIZE: 0603; PACKAGE_TYPE: Surface Mount; VENDOR: Digikey; VPN: 541-27.0HCT-ND
R12 = Resistor:R-US: Resistor Fixed - ANSI; CATEGORY: Resistors; DESCRIPTION: Chip Resistor 1.60 X 0.82 X 0.60 mm body 0603(1608-METRIC) Package; PACKAGE_SIZE: 0603; PACKAGE_TYPE: Surface Mount; VENDOR: Digikey; VPN: 541-13.0KHCT-ND
R14 = Resistor:R-US: Resistor Fixed - ANSI; CATEGORY: Resistors; DESCRIPTION: Chip Resistor 1.60 X 0.82 X 0.60 mm body 0603(1608-METRIC) Package; PACKAGE_SIZE: 0603; PACKAGE_TYPE: Surface Mount; VENDOR: Digikey; VPN: 541-604HCT-ND
R15 = Resistor:R-US: Resistor Fixed - ANSI; CATEGORY: Resistors; DESCRIPTION: Chip Resistor 1.60 X 0.82 X 0.60 mm body 0603(1608-METRIC) Package; PACKAGE_SIZE: 0603; PACKAGE_TYPE: Surface Mount; VENDOR: Digikey; VPN: 541-732KHCT-ND
R16 R24 = Resistor:R-US: Resistor Fixed - ANSI; CATEGORY: Resistors; DESCRIPTION: Chip Resistor 1.60 X 0.82 X 0.60 mm body 0603(1608-METRIC) Package; PACKAGE_SIZE: 0603; PACKAGE_TYPE: Surface Mount; VENDOR: Digikey; VPN: 541-100KHCT-ND
R19 R20 = Resistor:R-US: Resistor Fixed - ANSI; CATEGORY: Resistors; DESCRIPTION: Chip Resistor 1.60 X 0.82 X 0.60 mm body 0603(1608-METRIC) Package; PACKAGE_SIZE: 0603; PACKAGE_TYPE: Surface Mount; VENDOR: Digikey; VPN: 541-5.10KHCT-ND
R22 = Resistor:R-US: Resistor Fixed - ANSI; CATEGORY: Resistors; DESCRIPTION: Chip Resistor 1.60 X 0.82 X 0.60 mm body 0603(1608-METRIC) Package; PACKAGE_SIZE: 0603; PACKAGE_TYPE: Surface Mount; VENDOR: Digikey; VPN: 541-2.20KHCT-ND
R25 R26 = Resistor:R-US: Resistor Fixed - ANSI; CATEGORY: Resistors; DESCRIPTION: Chip Resistor 1.60 X 0.82 X 0.60 mm body 0603(1608-METRIC) Package; PACKAGE_SIZE: 0603; PACKAGE_TYPE: Surface Mount; VENDOR: Digikey; VPN: 541-200HCT-ND
SPEAKER = CMS-160925-078S:CMS-160925-078S; MANUFACTURER: CUI INC; PART_REV: 1.0; STANDARD: Manufacturer recommendations; VENDOR: Digikey; VPN: 102-4619-ND
TP1-TP14 = testpad:TP: Test pad
U2 = SC0914_13_:SC0914(13); MANUFACTURER: Raspberry Pi; MAXIMUM_PACKAGE_HEIGHT: 0.90 mm; PARTREV: 2.2; STANDARD: IPC 7351B; VENDOR: Digikey; VPN: 2648-SC0914(13)CT-ND
U3 = BQ25185DLHR:BQ25185DLHR; CREATOR: AMINA; MANUFACTURER: Texas Instruments; MAXIMUM_PACKAGE_HEIGHT: 0.8mm; PARTREV: OCTOBER 2023; SNAPEDA_PACKAGE_ID: 124517; STANDARD: Manufacturer Recommendations; VENDOR: Digikey; VPN: 296-BQ25185DLHRCT-ND
U4 = TPS61023DRLR:TPS61023DRLR; COPYRIGHT: Copyright (C) 2026 Ultra Librarian. All rights reserved.; DATASHEET: https://www.ti.com/lit/gpn/tps61023; DESCRIPTION: 3.7-A boost converter with 0.5-V ultra-low input voltage 6-SOT-5X3 -40 to 125; MANUFACTURER_NAME: Texas Instruments; MANUFACTURER_PART_NUMBER: TPS61023DRLR; REFDES: RefDes; TYPE: TYPE; VENDOR: Digikey; VPN: 296-TPS61023DRLRCT-ND
U5 = FSUSB42MUX:FSUSB42MUX; MANUFACTURER: ON Semiconductor; PARTREV: 1.25; STANDARD: IPC-7351B; VENDOR: Digikey; VPN: FSUSB42MUXCT-ND
U6 = MAX17048G_T10:MAX17048G+T10; VENDOR: Digikey; VPN: MAX17048G+T10CT-ND
U7 = TLV320DAC3100IRHBR:TLV320DAC3100IRHBR; VENDOR: Digikey; VPN: 296-27216-1-ND
U8 = W25Q32JVZPIQ:W25Q32JVZPIQ; CHECK_PRICES: https://www.snapeda.com/parts/W25Q32JVZPIQ/Winbond/view-part/?ref=eda; DESCRIPTION: FLASH - NOR Memory IC 32Mb (4M x 8) SPI - Quad I/O 133 MHz 8-WSON (6x5); DIGIKEY_PART_NUMBER: 256-W25Q32JVZPIQ-TUBE-ND; MF: Winbond; MP: W25Q32JVZPIQ; PACKAGE: WSON-8 Winbond; SNAPEDA_LINK: https://www.snapeda.com/parts/W25Q32JVZPIQ/Winbond/view-part/?ref=snap; VENDOR: Digikey; VPN: 256-W25Q32JVZPIQ-TUBE-ND
U$1 = CM0:CM0100000; VENDOR: EDATEC
Y1 = ABM8-272-T3:ABM8-272-T3; CREATOR: DIZAR; MANUFACTURER: ABRACON; MAXIMUM_PACKAGE_HEIGHT: 0.8mm; PARTREV: 07-29-20; STANDARD: Manufacturer Recommendations; VENDOR: Digikey; VPN: 535-ABM8-272-T3CT-ND